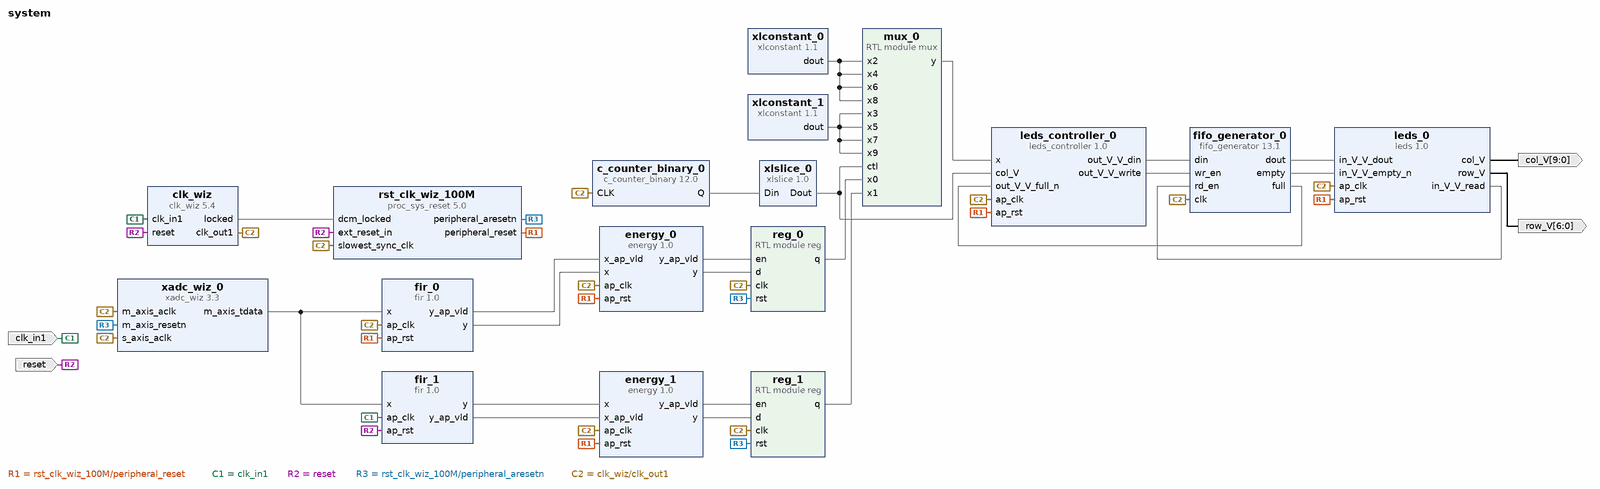
[diagram p0: block diagram of the top level]
# Vivado block design system, xc7z010clg400-1, Vivado 2017.2
create_bd_design system

create_bd_port -dir I -type clk clk_in1
create_bd_port -dir I -type rst reset
set_property -dict {CONFIG.POLARITY ACTIVE_HIGH} [get_bd_ports reset]
create_bd_port -dir O -from 6 -to 0 -type data row_V
create_bd_port -dir O -from 9 -to 0 -type data col_V

create_bd_cell -type ip -vlnv xilinx.com:hls:fir:1.0 fir_0
create_bd_cell -type ip -vlnv xilinx.com:ip:clk_wiz:5.4 clk_wiz
create_bd_cell -type ip -vlnv xilinx.com:ip:proc_sys_reset:5.0 rst_clk_wiz_100M
create_bd_cell -type ip -vlnv xilinx.com:hls:fir:1.0 fir_1
create_bd_cell -type ip -vlnv xilinx.com:ip:c_counter_binary:12.0 c_counter_binary_0
set_property -dict [list \
  CONFIG.Output_Width 12 \
  CONFIG.Restrict_Count true \
  CONFIG.Final_Count_Value A00 \
] [get_bd_cells c_counter_binary_0]
create_bd_cell -type ip -vlnv xilinx.com:ip:xadc_wiz:3.3 xadc_wiz_0
set_property -dict [list \
  CONFIG.INTERFACE_SELECTION None \
  CONFIG.WAVEFORM_TYPE SIN \
  CONFIG.STIMULUS_FREQ 1 \
  CONFIG.ENABLE_RESET true \
  CONFIG.OT_ALARM false \
  CONFIG.USER_TEMP_ALARM false \
  CONFIG.VCCINT_ALARM false \
  CONFIG.VCCAUX_ALARM false \
  CONFIG.ENABLE_VCCPINT_ALARM false \
  CONFIG.ENABLE_VCCPAUX_ALARM false \
  CONFIG.ENABLE_VCCDDRO_ALARM false \
  CONFIG.SINGLE_CHANNEL_SELECTION VAUXP14_VAUXN14 \
  CONFIG.SINGLE_CHANNEL_ENABLE_CALIBRATION true \
  CONFIG.ENABLE_EXTERNAL_MUX false \
  CONFIG.EXTERNAL_MUX_CHANNEL VP_VN \
  CONFIG.ENABLE_AXI4STREAM true \
] [get_bd_cells xadc_wiz_0]
create_bd_cell -type ip -vlnv xilinx.com:hls:energy:1.0 energy_1
create_bd_cell -type ip -vlnv xilinx.com:hls:energy:1.0 energy_0
create_bd_cell -type module -reference reg reg_0
create_bd_cell -type ip -vlnv xilinx.com:ip:fifo_generator:13.1 fifo_generator_0
set_property -dict {CONFIG.Input_Data_Width 7 CONFIG.Output_Data_Width 7} [get_bd_cells fifo_generator_0]
create_bd_cell -type module -reference reg reg_1
create_bd_cell -type module -reference mux mux_0
create_bd_cell -type ip -vlnv xilinx.com:ip:xlconstant:1.1 xlconstant_0
set_property -dict {CONFIG.CONST_WIDTH 16 CONFIG.CONST_VAL 0} [get_bd_cells xlconstant_0]
create_bd_cell -type ip -vlnv xilinx.com:ip:xlconstant:1.1 xlconstant_1
set_property -dict {CONFIG.CONST_WIDTH 16 CONFIG.CONST_VAL 10000} [get_bd_cells xlconstant_1]
create_bd_cell -type ip -vlnv xilinx.com:hls:leds:1.0 leds_0
create_bd_cell -type ip -vlnv xilinx.com:ip:xlslice:1.0 xlslice_0
set_property -dict {CONFIG.DIN_TO 8 CONFIG.DIN_FROM 11 CONFIG.DIN_WIDTH 12 CONFIG.DOUT_WIDTH 4} [get_bd_cells xlslice_0]
create_bd_cell -type ip -vlnv xilinx.com:hls:leds_controller:1.0 leds_controller_0

# ---- connections ----

connect_bd_net -net x_1 [get_bd_pins xadc_wiz_0/m_axis_tdata] [get_bd_pins fir_0/x] [get_bd_pins fir_1/x]
connect_bd_net [get_bd_pins clk_wiz/locked] [get_bd_pins rst_clk_wiz_100M/dcm_locked]
connect_bd_net [get_bd_pins rst_clk_wiz_100M/peripheral_reset] \
  [get_bd_pins fir_0/ap_rst] [get_bd_pins energy_1/ap_rst] [get_bd_pins energy_0/ap_rst] [get_bd_pins leds_0/ap_rst] \
  [get_bd_pins leds_controller_0/ap_rst]
connect_bd_net -net clk_in1_1 [get_bd_ports clk_in1] [get_bd_pins clk_wiz/clk_in1] [get_bd_pins fir_1/ap_clk]
connect_bd_net [get_bd_ports reset] [get_bd_pins clk_wiz/reset] [get_bd_pins rst_clk_wiz_100M/ext_reset_in] [get_bd_pins fir_1/ap_rst]
connect_bd_net [get_bd_pins fir_1/y] [get_bd_pins energy_1/x]
connect_bd_net [get_bd_pins fir_1/y_ap_vld] [get_bd_pins energy_1/x_ap_vld]
connect_bd_net [get_bd_pins fir_0/y_ap_vld] [get_bd_pins energy_0/x_ap_vld]
connect_bd_net [get_bd_pins rst_clk_wiz_100M/peripheral_aresetn] \
  [get_bd_pins reg_0/rst] [get_bd_pins reg_1/rst] [get_bd_pins xadc_wiz_0/m_axis_resetn]
connect_bd_net [get_bd_pins fir_0/y] [get_bd_pins energy_0/x]
connect_bd_net [get_bd_pins energy_0/y_ap_vld] [get_bd_pins reg_0/en]
connect_bd_net [get_bd_pins energy_0/y] [get_bd_pins reg_0/d]
connect_bd_net [get_bd_pins reg_0/q] [get_bd_pins mux_0/x0]
connect_bd_net [get_bd_pins clk_wiz/clk_out1] \
  [get_bd_pins fir_0/ap_clk] [get_bd_pins rst_clk_wiz_100M/slowest_sync_clk] [get_bd_pins xadc_wiz_0/s_axis_aclk] \
  [get_bd_pins energy_1/ap_clk] [get_bd_pins energy_0/ap_clk] [get_bd_pins reg_0/clk] [get_bd_pins fifo_generator_0/clk] \
  [get_bd_pins reg_1/clk] [get_bd_pins leds_0/ap_clk] [get_bd_pins xadc_wiz_0/m_axis_aclk] \
  [get_bd_pins c_counter_binary_0/CLK] [get_bd_pins leds_controller_0/ap_clk]
connect_bd_net [get_bd_pins energy_1/y_ap_vld] [get_bd_pins reg_1/en]
connect_bd_net [get_bd_pins energy_1/y] [get_bd_pins reg_1/d]
connect_bd_net [get_bd_pins reg_1/q] [get_bd_pins mux_0/x1]
connect_bd_net [get_bd_pins xlconstant_0/dout] [get_bd_pins mux_0/x2] [get_bd_pins mux_0/x4] [get_bd_pins mux_0/x6] [get_bd_pins mux_0/x8]
connect_bd_net [get_bd_pins xlconstant_1/dout] [get_bd_pins mux_0/x9] [get_bd_pins mux_0/x7] [get_bd_pins mux_0/x5] [get_bd_pins mux_0/x3]
connect_bd_net [get_bd_pins fifo_generator_0/dout] [get_bd_pins leds_0/in_V_V_dout]
connect_bd_net [get_bd_pins fifo_generator_0/empty] [get_bd_pins leds_0/in_V_V_empty_n]
connect_bd_net [get_bd_pins leds_0/in_V_V_read] [get_bd_pins fifo_generator_0/rd_en]
connect_bd_net [get_bd_pins leds_0/row_V] [get_bd_ports row_V]
connect_bd_net [get_bd_pins leds_0/col_V] [get_bd_ports col_V]
connect_bd_net [get_bd_pins c_counter_binary_0/Q] [get_bd_pins xlslice_0/Din]
connect_bd_net [get_bd_pins xlslice_0/Dout] [get_bd_pins mux_0/ctl] [get_bd_pins leds_controller_0/col_V]
connect_bd_net [get_bd_pins leds_controller_0/out_V_V_din] [get_bd_pins fifo_generator_0/din]
connect_bd_net [get_bd_pins fifo_generator_0/full] [get_bd_pins leds_controller_0/out_V_V_full_n]
connect_bd_net [get_bd_pins leds_controller_0/out_V_V_write] [get_bd_pins fifo_generator_0/wr_en]
connect_bd_net [get_bd_pins mux_0/y] [get_bd_pins leds_controller_0/x]

validate_bd_design
save_bd_design
